# EAGLE schematic gms (EAGLE 9.6.2)

## Sheet 1 of 2
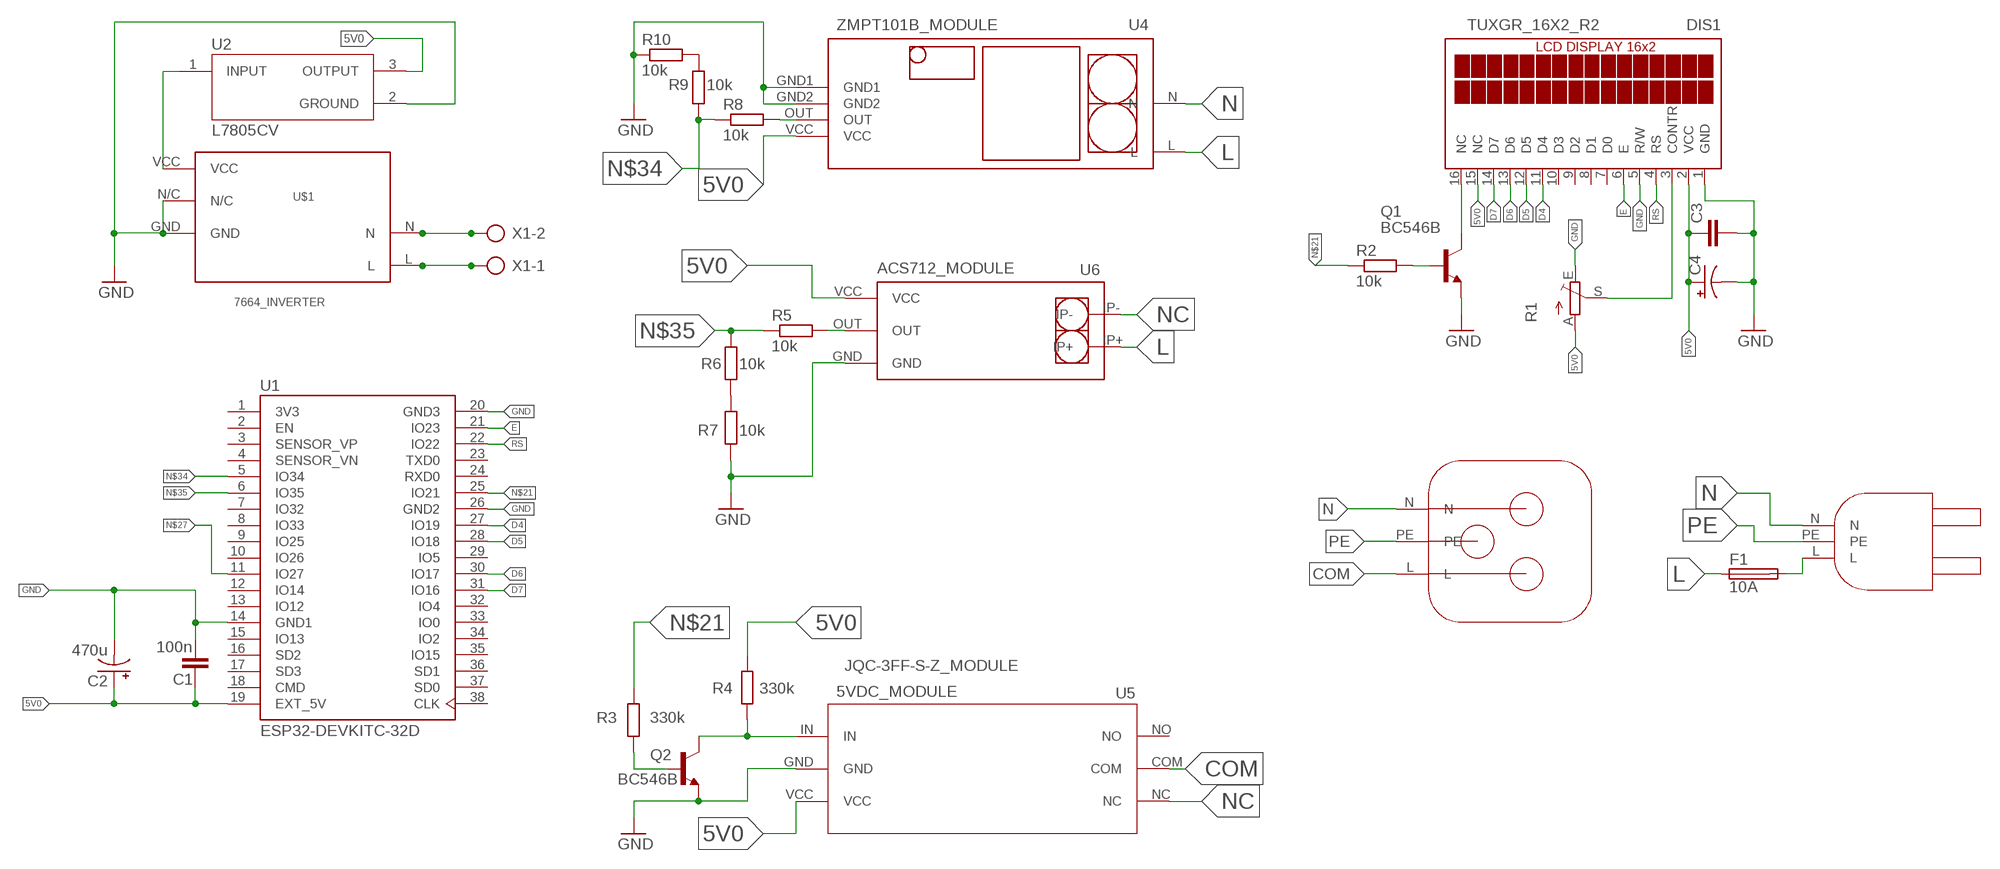
[diagram p0: schematic, sheet 1]

### Parts
C1  100n  C-EU025-025X050  [C025-025X050]
C2  470u  CPOL-USE2.5-6  [E2,5-6]
C3  C-EU025-025X050  [C025-025X050]
C4  CPOL-USE2.5-6  [E2,5-6]
DIS1  TUXGR_16X2_R2  [TUXGR_16X2_R2]
F1  10A  SH25  [SH25]
Q1  BC546B  [TO92-EBC]
Q2  BC546B  [TO92-EBC]
R1  TRIM_EU-CA6V  [CA6V]
R2  10k  R-EU_0204/7  [0204/7]
R3  330k  R-EU_0204/7  [0204/7]
R4  330k  R-EU_0204/7  [0204/7]
R5  10k  R-EU_0204/7  [0204/7]
R6  10k  R-EU_0204/7  [0204/7]
R7  10k  R-EU_0204/7  [0204/7]
R8  10k  R-EU_0204/7  [0204/7]
R9  10k  R-EU_0204/7  [0204/7]
R10  10k  R-EU_0204/7  [0204/7]
U1  ESP32-DEVKITC-32D  [MODULE_ESP32-DEVKITC-32D]
U2  L7805CV  [TO255P1040X460X1968-3]
U4  ZMPT101B_MODULE  [ZMPT101B_MODULE]
U5  5VDC_MODULE  [5VDC_MODULE]
U6  ACS712_MODULE  [ACS712_MODULE]
U$1  7664_INVERTER  [7664_INVERTER]
U$5  CEE_77_PLUG  [CEE_77_PLUG]
U$6  CEE_77_SOCKET  [CEE_77_SOCKET]
X1  AK500/2  [AK500/2]

### Nets
5V0: C1.2 C2.+ C3.1 C4.+ DIS1.2(VCC) DIS1.15(NC) R1.A R4.2 U1.19(EXT_5V) U2.3(OUTPUT) U4.VCC U5.VCC U6.VCC
12V0: U2.1(INPUT) U$1.VCC
COM: U5.COM U$6.L
D4: DIS1.11(D4) U1.27(IO19)
D5: DIS1.12(D5) U1.28(IO18)
D6: DIS1.13(D6) U1.30(IO17)
D7: DIS1.14(D7) U1.31(IO16)
E: DIS1.6(E) U1.21(IO23)
GND: C1.1 C2.- C3.2 C4.- DIS1.1(GND) DIS1.5(R/W) Q1.E Q2.E R1.E R7.1 R10.1 U1.14(GND1) U1.20(GND3) U1.26(GND2) U2.2(GROUND) U4.GND1 U4.GND2 U5.GND U6.GND U$1.GND U$1.N/C
L: F1.1 U4.L U6.IP+ U$1.L X1.1
N: U4.N U$1.N U$5.N U$6.N X1.2
N$1: Q2.B R3.2
N$2: DIS1.3(CONTR) R1.S
N$3: R9.2 R10.2
N$5: DIS1.16(NC) Q1.C
N$6: Q1.B R2.2
N$7: Q2.C R4.1 U5.IN
N$8: R8.2 U4.OUT
N$9: R5.2 U6.OUT
N$10: R6.1 R7.2
N$11: F1.2 U$5.L
N$21: R2.1 R3.1 U1.25(IO21)
N$27: U1.11(IO27)
N$34: R8.1 R9.1 U1.5(IO34)
N$35: R5.1 R6.2 U1.6(IO35)
NC: U5.NC U6.IP-
PE: U$5.PE U$6.PE
RS: DIS1.4(RS) U1.22(IO22)
Unconnected: DIS1.7(D0) DIS1.8(D1) DIS1.9(D2) DIS1.10(D3) U1.2(EN) U1.3(SENSOR_VP) U1.4(SENSOR_VN) U1.7(IO32) U1.8(IO33) U1.9(IO25) U1.10(IO26) U1.12(IO14) U1.13(IO12) U1.15(IO13) U1.16(SD2) U1.17(SD3) U1.18(CMD) U1.23(TXD0) U1.24(RXD0) U1.29(IO5) U1.32(IO4) U1.33(IO0) U1.34(IO2) U1.35(IO15) U1.36(SD1) U1.37(SD0) U1.38(CLK) U5.NO

### Notes on the sheet
- JQC-3FF-S-Z_MODULE

## Sheet 2 of 2

## Power pins joined to a net without a drawn wire
3V3: U1.1(3V3)

## Library data of the parts
C1 C3 = rcl:C-EU: CAPACITOR, European symbol; SPICEPREFIX: C
C2 C4 = rcl:CPOL-US: POLARIZED CAPACITOR, American symbol; SPICEPREFIX: C
DIS1 = display-lcd:TUXGR_16X2_R2: Tuxgraphics LCD display 16x2 characters reflective, without background light Source: tuxgr_12x2_r2.pdf; OC_FARNELL: unknown; OC_NEWARK: unknown
F1 = fuse:SH25: FUSE HOLDER grid 25 mm, OGN0031 8211, Schurter (Buerklin); MF: SCHURTER; MPN: 0031.8211; OC_FARNELL: 1162741; OC_NEWARK: 96B9380
Q1 Q2 = transistor-npn:BC546*: NPN Transistor
R1 = pot:TRIM_EU-: POTENTIOMETER
R2-R10 = rcl:R-EU_: RESISTOR, European symbol; SPICEPREFIX: R
U1 = ESP32-DEVKITC-32D:ESP32-DEVKITC-32D: Eval Board For Esp-Wroom-32 Check availability <https://pricing.snapeda.com/parts/ESP32-DEVKITC-32D/Espressif%20Systems/view-part?ref=eda>; AVAILABILITY: In Stock; DESCRIPTION: WiFi Development Tools (802.11) ESP32 General Development Kit, ESP32-WROOM-32D on the board; MF: Espressif Systems; MP: ESP32-DEVKITC-32D; PACKAGE: None; PRICE: None; PURCHASE-URL: https://pricing.snapeda.com/search/part/ESP32-DEVKITC-32D/?ref=eda
U2 = L7805CV:L7805CV: Standard Regulator Pos 5V 1.5A 3-Pin(3+Tab) TO-220 Standard Regulator Pos 5V 1.5A 3-Pin(3+Tab) TO-220 Check availability <https://pricing.snapeda.com/parts/L7805CV/STMicroelectronics/view-part?ref=eda>; AVAILABILITY: In Stock; DESCRIPTION: Linear Voltage Regulator IC Positive Fixed 1 Output 1.5A TO-220; MF: STMicroelectronics; MP: L7805CV; PACKAGE: TO-220-3 ON Semiconductor; PRICE: None; PURCHASE-URL: https://pricing.snapeda.com/search/part/L7805CV/?ref=eda
U4 = ACS712_Module:ZMPT101B_MODULE
U5 = ACS712_Module:5VDC_MODULE
U6 = ACS712_Module:ACS712_MODULE
U$1 = ACS712_Module:7664_INVERTER
U$5 = ACS712_Module:CEE_77_PLUG
U$6 = ACS712_Module:CEE_77_SOCKET
X1 = con-ptr500:AK500/2: CONNECTOR; OC_FARNELL: unknown; OC_NEWARK: unknown